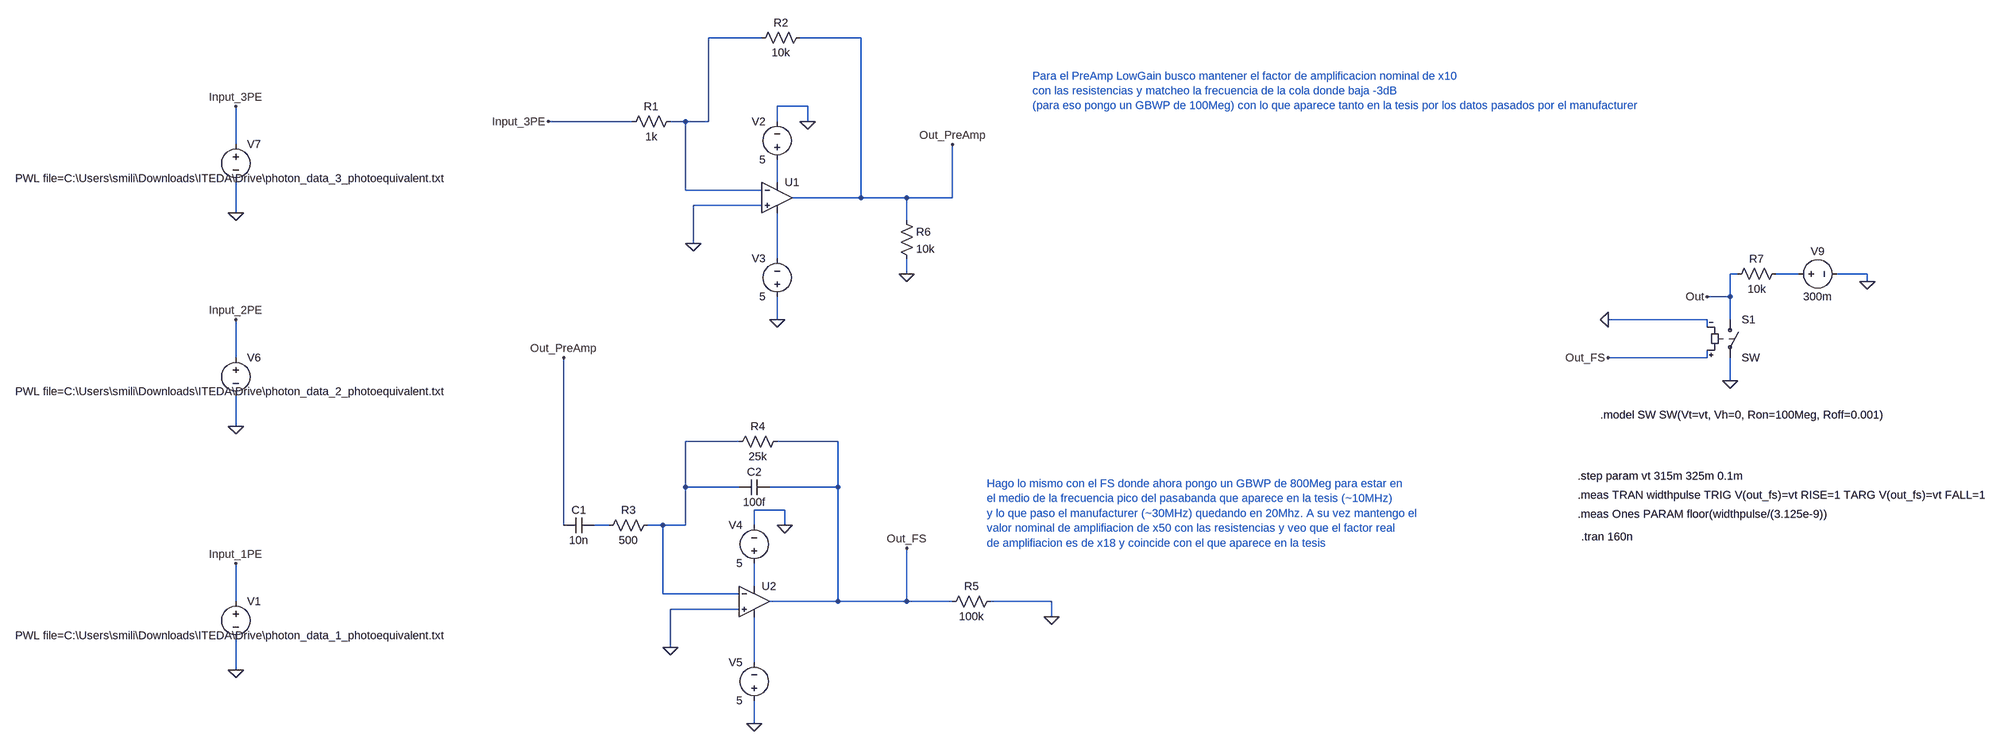
[diagram p0: schematic full_electronic_v4.asc]
full_electronic_v4.asc, the LTspice schematic file:
Version 4
SHEET 1 2920 820
WIRE 144 -800 32 -800
WIRE 352 -800 224 -800
WIRE 240 -656 176 -656
WIRE -128 -624 -304 -624
WIRE -16 -624 -48 -624
WIRE 32 -624 32 -800
WIRE 32 -624 -16 -624
WIRE 176 -624 176 -656
WIRE 240 -624 240 -656
WIRE -960 -576 -960 -656
WIRE 176 -496 176 -544
WIRE -16 -480 -16 -624
WIRE 144 -480 -16 -480
WIRE 352 -464 352 -800
WIRE 352 -464 208 -464
WIRE 448 -464 352 -464
WIRE 544 -464 544 -576
WIRE 544 -464 448 -464
WIRE 144 -448 0 -448
WIRE -960 -432 -960 -496
WIRE 448 -416 448 -464
WIRE 0 -368 0 -448
WIRE 176 -336 176 -432
WIRE 448 -304 448 -336
WIRE 2192 -304 2176 -304
WIRE 2320 -304 2272 -304
WIRE 2464 -304 2400 -304
WIRE 2464 -288 2464 -304
WIRE 2176 -256 2176 -304
WIRE 2176 -256 2128 -256
WIRE 176 -208 176 -256
WIRE 2128 -208 1920 -208
WIRE 2176 -208 2176 -256
WIRE 2128 -192 2128 -208
WIRE -960 -128 -960 -208
WIRE 2128 -128 2128 -144
WIRE 2128 -128 1920 -128
WIRE 2176 -80 2176 -128
WIRE -960 16 -960 -48
WIRE 96 48 -16 48
WIRE 304 48 176 48
WIRE -16 144 -16 48
WIRE 96 144 -16 144
WIRE 304 144 304 48
WIRE 304 144 160 144
WIRE 192 192 128 192
WIRE -272 224 -272 -128
WIRE -176 224 -208 224
WIRE -64 224 -96 224
WIRE -16 224 -16 144
WIRE -16 224 -64 224
WIRE 128 224 128 192
WIRE 192 224 192 192
WIRE 128 352 128 304
WIRE -64 368 -64 224
WIRE 96 368 -64 368
WIRE -960 384 -960 304
WIRE 304 384 304 144
WIRE 304 384 160 384
WIRE 448 384 448 272
WIRE 448 384 304 384
WIRE 544 384 448 384
WIRE 752 384 624 384
WIRE 96 400 -48 400
WIRE 752 416 752 384
WIRE -48 480 -48 400
WIRE 128 512 128 416
WIRE -960 528 -960 464
WIRE 128 640 128 592
FLAG 176 -208 0
FLAG 240 -624 0
FLAG -960 528 0
FLAG 0 -368 0
FLAG 128 640 0
FLAG 192 224 0
FLAG -48 480 0
FLAG 544 -576 Out_PreAmp
FLAG 448 272 Out_FS
FLAG 752 416 0
FLAG -272 -128 Out_PreAmp
FLAG -960 304 Input_1PE
FLAG -960 16 0
FLAG -960 -208 Input_2PE
FLAG -304 -624 Input_3PE
FLAG 448 -304 0
FLAG -960 -432 0
FLAG -960 -656 Input_3PE
FLAG 2176 -80 0
FLAG 2464 -288 0
FLAG 2128 -256 Out
FLAG 1920 -208 0
FLAG 1920 -128 Out_FS
SYMBOL res -32 -640 R90
WINDOW 0 0 56 VBottom 2
WINDOW 3 32 56 VTop 2
SYMATTR InstName R1
SYMATTR Value 1k
SYMBOL res 240 -816 R90
WINDOW 0 0 56 VBottom 2
WINDOW 3 32 56 VTop 2
SYMATTR InstName R2
SYMATTR Value 10k
SYMBOL voltage 176 -528 R180
WINDOW 0 24 96 Left 2
WINDOW 3 24 16 Left 2
WINDOW 123 0 0 Left 0
WINDOW 39 0 0 Left 0
SYMATTR InstName V2
SYMATTR Value 5
SYMBOL voltage 176 -240 R180
WINDOW 0 24 96 Left 2
WINDOW 3 24 16 Left 2
WINDOW 123 0 0 Left 0
WINDOW 39 0 0 Left 0
SYMATTR InstName V3
SYMATTR Value 5
SYMBOL OpAmps\\UniversalOpAmp1 176 -464 R0
SYMATTR InstName U1
SYMATTR Value2 Avol=1Meg GBW=500Meg Vos=0
SYMBOL res -80 208 R90
WINDOW 0 0 56 VBottom 2
WINDOW 3 32 56 VTop 2
SYMATTR InstName R3
SYMATTR Value 500
SYMBOL res 192 32 R90
WINDOW 0 0 56 VBottom 2
WINDOW 3 32 56 VTop 2
SYMATTR InstName R4
SYMATTR Value 25k
SYMBOL voltage 128 320 R180
WINDOW 0 24 96 Left 2
WINDOW 3 24 16 Left 2
WINDOW 123 0 0 Left 0
WINDOW 39 0 0 Left 0
SYMATTR InstName V4
SYMATTR Value 5
SYMBOL voltage 128 608 R180
WINDOW 0 24 96 Left 2
WINDOW 3 24 16 Left 2
WINDOW 123 0 0 Left 0
WINDOW 39 0 0 Left 0
SYMATTR InstName V5
SYMATTR Value 5
SYMBOL OpAmps\\UniversalOpAmp1 128 384 R0
SYMATTR InstName U2
SYMATTR Value2 Avol=1Meg GBW=800Meg Vos=0
SYMBOL voltage -960 368 R0
WINDOW 3 -463 87 Left 2
WINDOW 123 0 0 Left 0
WINDOW 39 0 0 Left 0
SYMATTR Value PWL file=C:\Users\smili\Downloads\ITEDA\Drive\photon_data_1_photoequivalent.txt
SYMATTR InstName V1
SYMBOL res 640 368 R90
WINDOW 0 0 56 VBottom 2
WINDOW 3 32 56 VTop 2
SYMATTR InstName R5
SYMATTR Value 100k
SYMBOL cap -208 208 R90
WINDOW 0 0 32 VBottom 2
WINDOW 3 32 32 VTop 2
SYMATTR InstName C1
SYMATTR Value 10n
SYMBOL cap 160 128 R90
WINDOW 0 0 32 VBottom 2
WINDOW 3 32 32 VTop 2
SYMATTR InstName C2
SYMATTR Value 100f
SYMBOL voltage -960 -144 R0
WINDOW 3 -463 87 Left 2
WINDOW 123 0 0 Left 0
WINDOW 39 0 0 Left 0
SYMATTR Value PWL file=C:\Users\smili\Downloads\ITEDA\Drive\photon_data_2_photoequivalent.txt
SYMATTR InstName V6
SYMBOL res 432 -432 R0
SYMATTR InstName R6
SYMATTR Value 10k
SYMBOL voltage -960 -592 R0
WINDOW 3 -463 87 Left 2
WINDOW 123 0 0 Left 0
WINDOW 39 0 0 Left 0
SYMATTR Value PWL file=C:\Users\smili\Downloads\ITEDA\Drive\photon_data_3_photoequivalent.txt
SYMATTR InstName V7
SYMBOL sw 2176 -224 R0
SYMATTR InstName S1
SYMBOL voltage 2304 -304 R270
WINDOW 0 32 56 VTop 2
WINDOW 3 -32 56 VBottom 2
SYMATTR InstName V9
SYMATTR Value 300m
SYMBOL res 2288 -320 R90
WINDOW 0 0 56 VBottom 2
WINDOW 3 32 56 VTop 2
SYMATTR InstName R7
SYMATTR Value 10k
TEXT 1864 248 Left 2 !.tran 160n
TEXT 712 -720 Left 2 ;Para el PreAmp LowGain busco mantener el factor de amplificacion nominal de x10 \ncon las resistencias y matcheo la frecuencia de la cola donde baja -3dB \n(para eso pongo un GBWP de 100Meg) con lo que aparece tanto en la tesis por los datos pasados por el manufacturer
TEXT 616 136 Left 2 ;Hago lo mismo con el FS donde ahora pongo un GBWP de 800Meg para estar en \nel medio de la frecuencia pico del pasabanda que aparece en la tesis (~10MHz)\ny lo que paso el manufacturer (~30MHz) quedando en 20Mhz. A su vez mantengo el \nvalor nominal de amplifiacion de x50 con las resistencias y veo que el factor real\nde amplifiacion es de x18 y coincide con el que aparece en la tesis
TEXT 1904 -8 Left 2 !.model SW SW(Vt=vt, Vh=0, Ron=100Meg, Roff=0.001)
TEXT 1856 120 Left 2 !.step param vt 315m 325m 0.1m
TEXT 1856 200 Left 2 !.meas Ones PARAM floor(widthpulse/(3.125e-9))
TEXT 1856 160 Left 2 !.meas TRAN widthpulse TRIG V(out_fs)=vt RISE=1 TARG V(out_fs)=vt FALL=1

The netlist it stands for:
* full_electronic_v4.asc
R1 N001 Input_3PE 1k
R2 Out_PreAmp N001 10k
V2 N002 0 5
V3 0 N003 5
XU1 0 N001 N002 N003 Out_PreAmp level1 Avol=1Meg GBW=500Meg Vos=0 En=0 Enk=0 In=0 Ink=0 Rin=500Meg  ; pins In+ In- V+ V- OUT
R3 N005 N006 500
R4 Out_FS N005 25k
V4 N007 0 5
V5 0 N008 5
XU2 0 N005 N007 N008 Out_FS level1 Avol=1Meg GBW=800Meg Vos=0 En=0 Enk=0 In=0 Ink=0 Rin=500Meg  ; pins In+ In- V+ V- OUT
V1 Input_1PE 0 PWL file=C:\Users\smili\Downloads\ITEDA\Drive\photon_data_1_photoequivalent.txt
R5 0 Out_FS 100k
C1 N006 Out_PreAmp 10n
C2 Out_FS N005 100f
V6 Input_2PE 0 PWL file=C:\Users\smili\Downloads\ITEDA\Drive\photon_data_2_photoequivalent.txt
R6 Out_PreAmp 0 10k
V7 Input_3PE 0 PWL file=C:\Users\smili\Downloads\ITEDA\Drive\photon_data_3_photoequivalent.txt
S1 Out 0 Out_FS 0 SW
V9 N004 0 300m
R7 N004 Out 10k
.tran 160n
* Para el PreAmp LowGain busco mantener el factor de amplificacion nominal de x10
* con las resistencias y matcheo la frecuencia de la cola donde baja -3dB
* (para eso pongo un GBWP de 100Meg) con lo que aparece tanto en la tesis por los datos pasados por el manufacturer
* Hago lo mismo con el FS donde ahora pongo un GBWP de 800Meg para estar en
* el medio de la frecuencia pico del pasabanda que aparece en la tesis (~10MHz)
* y lo que paso el manufacturer (~30MHz) quedando en 20Mhz. A su vez mantengo el
* valor nominal de amplifiacion de x50 con las resistencias y veo que el factor real
* de amplifiacion es de x18 y coincide con el que aparece en la tesis
.model SW SW(Vt=vt, Vh=0, Ron=100Meg, Roff=0.001)
.step param vt 315m 325m 0.1m
.meas Ones PARAM floor(widthpulse/(3.125e-9))
.meas TRAN widthpulse TRIG V(out_fs)=vt RISE=1 TARG V(out_fs)=vt FALL=1
.lib UniversalOpAmp1.lib
.backanno
.end